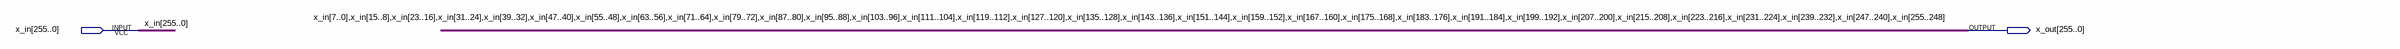
[diagram p0: schematic sheet]
// Quartus schematic LBE_short.bdf as structural Verilog: 0 symbols, 2 pins
module LBE_short (
  input  [255:0] x_in,
  output [255:0] x_out
);


  assign x_out = {x_in[7:0], x_in[15:8], x_in[23:16], x_in[31:24], x_in[39:32], x_in[47:40], x_in[55:48], x_in[63:56], x_in[71:64], x_in[79:72], x_in[87:80], x_in[95:88], x_in[103:96], x_in[111:104], x_in[119:112], x_in[127:120], x_in[135:128], x_in[143:136], x_in[151:144], x_in[159:152], x_in[167:160], x_in[175:168], x_in[183:176], x_in[191:184], x_in[199:192], x_in[207:200], x_in[215:208], x_in[223:216], x_in[231:224], x_in[239:232], x_in[247:240], x_in[255:248]};
endmodule
